# EAGLE design 8channelsULN2803 (EAGLE 5.11)
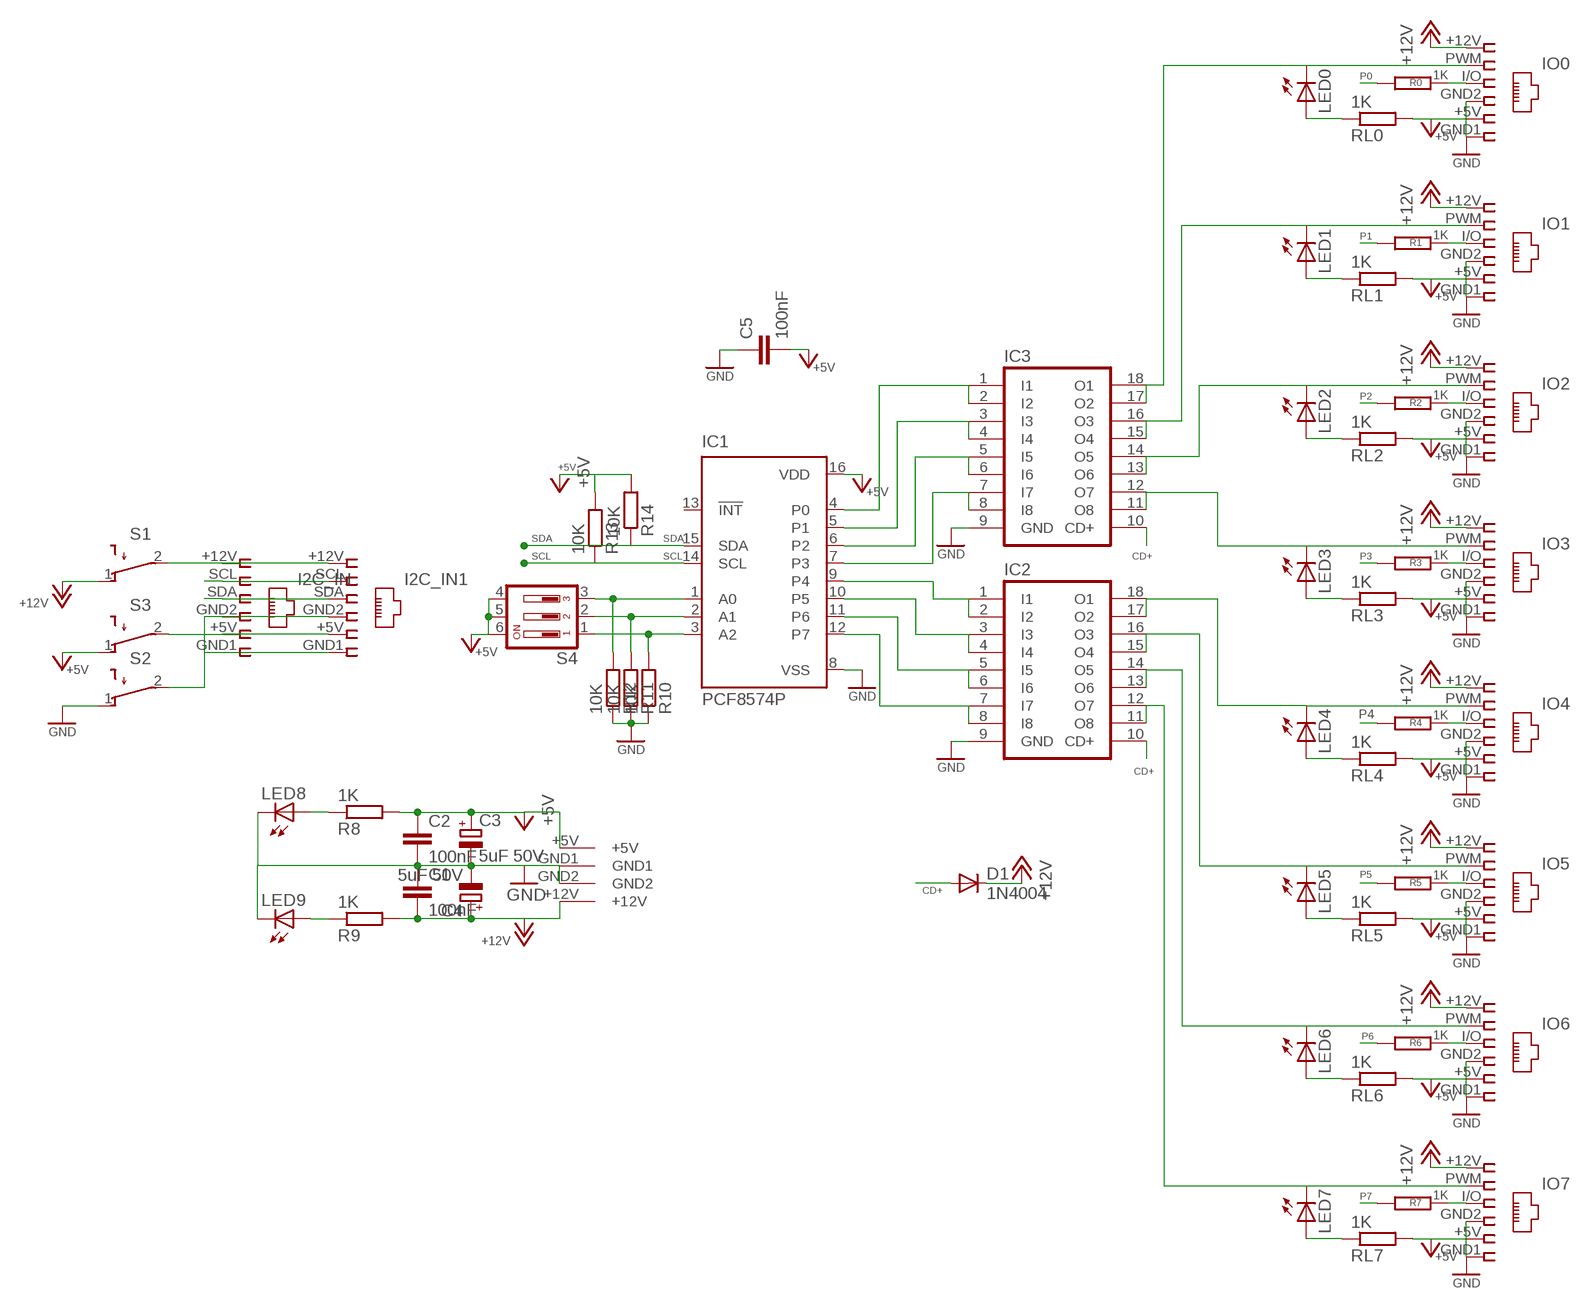
[diagram p0: schematic, sheet 1]

## Parts
C1  100nF  C-EUC1206  [C1206]
C2  100nF  C-EUC1206  [C1206]
C3  5uF 50V  CPOL-EUE3.5-8  [E3,5-8]
C4  5uF 50V  CPOL-EUE3.5-8  [E3,5-8]
C5  100nF  C-EUC1206  [C1206]
D1  1N4004  [DO41-10]
I2C_IN  I2C 1  RJ12STRAIGHT-I2C  [RJ12-STRAIGHT-I2C]
I2C_IN1  I2C 2  RJ12STRAIGHT-I2C  [RJ12-STRAIGHT-I2C]
IC1  PCF8574P  [DIL16]
IC2  ULN2803A  [DIL18]
IC3  ULN2803A  [DIL18]
IO0  IO0  RJ12STRAIGHT  [RJ12-STRAIGHT]
IO1  IO1  RJ12STRAIGHT  [RJ12-STRAIGHT]
IO2  IO2  RJ12STRAIGHT  [RJ12-STRAIGHT]
IO3  IO3  RJ12STRAIGHT  [RJ12-STRAIGHT]
IO4  IO4  RJ12STRAIGHT  [RJ12-STRAIGHT]
IO5  IO5  RJ12STRAIGHT  [RJ12-STRAIGHT]
IO6  IO6  RJ12STRAIGHT  [RJ12-STRAIGHT]
IO7  IO7  RJ12STRAIGHT  [RJ12-STRAIGHT]
LED0  LED3MM  [LED3MM]
LED1  LED3MM  [LED3MM]
LED2  LED3MM  [LED3MM]
LED3  LED3MM  [LED3MM]
LED4  LED3MM  [LED3MM]
LED5  LED3MM  [LED3MM]
LED6  LED3MM  [LED3MM]
LED7  LED3MM  [LED3MM]
LED8  LED3MM  [LED3MM]
LED9  LED3MM  [LED3MM]
R0  1K  R-EU_M1206  [M1206]
R1  1K  R-EU_M1206  [M1206]
R2  1K  R-EU_M1206  [M1206]
R3  1K  R-EU_M1206  [M1206]
R4  1K  R-EU_M1206  [M1206]
R5  1K  R-EU_M1206  [M1206]
R6  1K  R-EU_M1206  [M1206]
R7  1K  R-EU_M1206  [M1206]
R8  1K  R-EU_M1206  [M1206]
R9  1K  R-EU_M1206  [M1206]
R10  10K  R-EU_M1206  [M1206]
R11  10K  R-EU_M1206  [M1206]
R12  10K  R-EU_M1206  [M1206]
R13  10K  R-EU_M1206  [M1206]
R14  10K  R-EU_M1206  [M1206]
RL0  1K  R-EU_M1206  [M1206]
RL1  1K  R-EU_M1206  [M1206]
RL2  1K  R-EU_M1206  [M1206]
RL3  1K  R-EU_M1206  [M1206]
RL4  1K  R-EU_M1206  [M1206]
RL5  1K  R-EU_M1206  [M1206]
RL6  1K  R-EU_M1206  [M1206]
RL7  1K  R-EU_M1206  [M1206]
S1  SWITCHSWITCH  [SWITCH2]
S2  SWITCHPAD  [PADS2]
S3  SWITCHSWITCH  [SWITCH2]
S4  DIP03YL  [DIP03YL]
U$2  KPJX-4S-S  [KPJX-4S-S]

## Nets
+5V [highpower]: C2.1 C3.+ C5.2 IC1.16(VDD) IO0.+5V IO1.+5V IO2.+5V IO3.+5V IO4.+5V IO5.+5V IO6.+5V IO7.+5V R8.2 R13.2 R14.2 RL0.2 RL1.2 RL2.2 RL3.2 RL4.2 RL5.2 RL6.2 RL7.2 S3.1(O) S4.4 S4.5 S4.6 U$2.+5V
+12V [highpower]: C1.2 C4.+ D1.C IO0.+12V IO1.+12V IO2.+12V IO3.+12V IO4.+12V IO5.+12V IO6.+12V IO7.+12V R9.2 S1.1(O) U$2.+12V
CD+: D1.A IC2.10(CD+) IC3.10(CD+)
D2B: IO4.I/O R4.1
D2B1: IO5.I/O R5.1
D2B2: IO6.I/O R6.1
D2B3: IO7.I/O R7.1
D2B4: IO0.I/O R0.1
D2B5: IO1.I/O R1.1
D2B6: IO2.I/O R2.1
D2B7: IO3.I/O R3.1
GND [highpower]: C1.1 C2.2 C3.- C4.- C5.1 IC1.8(VSS) IC2.9(GND) IC3.9(GND) IO0.GND1 IO0.GND2 IO1.GND1 IO1.GND2 IO2.GND1 IO2.GND2 IO3.GND1 IO3.GND2 IO4.GND1 IO4.GND2 IO5.GND1 IO5.GND2 IO6.GND1 IO6.GND2 IO7.GND1 IO7.GND2 LED8.K(C) LED9.K(C) R10.1 R11.1 R12.1 S2.1(O) U$2.GND1 U$2.GND2
N$1 [power]: IC3.15(O4) IC3.16(O3) IO1.PWM LED1.K(C)
N$2: LED0.A RL0.1
N$3 [power]: IC3.17(O2) IC3.18(O1) IO0.PWM LED0.K(C)
N$4: LED1.A RL1.1
N$5 [highpower]: I2C_IN1.+12V I2C_IN.+12V S1.2(P)
N$6 [power]: IC2.13(O6) IC2.14(O5) IO6.PWM LED6.K(C)
N$7 [highpower]: I2C_IN1.+5V I2C_IN.+5V S3.2(P)
N$8 [power]: IC2.17(O2) IC2.18(O1) IO4.PWM LED4.K(C)
N$9 [power]: IC3.11(O8) IC3.12(O7) IO3.PWM LED3.K(C)
N$10 [highpower]: I2C_IN1.GND1 I2C_IN1.GND2 I2C_IN.GND1 I2C_IN.GND2 S2.2(P)
N$12: LED5.A RL5.1
N$13: LED9.A R9.1
N$15: LED4.A RL4.1
N$16: IC1.1(A0) R12.2 S4.3
N$17: IC1.2(A1) R11.2 S4.2
N$18: IC1.3(A2) R10.2 S4.1
N$21: LED6.A RL6.1
N$23: LED8.A R8.1
N$28: LED7.A RL7.1
N$38: LED2.A RL2.1
N$40 [power]: IC3.13(O6) IC3.14(O5) IO2.PWM LED2.K(C)
N$41: LED3.A RL3.1
N$42 [power]: IC2.15(O4) IC2.16(O3) IO5.PWM LED5.K(C)
N$44 [power]: IC2.11(O8) IC2.12(O7) IO7.PWM LED7.K(C)
P0: IC1.4(P0) IC3.1(I1) IC3.2(I2) R0.2
P1: IC1.5(P1) IC3.3(I3) IC3.4(I4) R1.2
P2: IC1.6(P2) IC3.5(I5) IC3.6(I6) R2.2
P3: IC1.7(P3) IC3.7(I7) IC3.8(I8) R3.2
P4: IC1.9(P4) IC2.1(I1) IC2.2(I2) R4.2
P5: IC1.10(P5) IC2.3(I3) IC2.4(I4) R5.2
P6: IC1.11(P6) IC2.5(I5) IC2.6(I6) R6.2
P7: IC1.12(P7) IC2.7(I7) IC2.8(I8) R7.2
SCL: I2C_IN1.SCL I2C_IN.SCL IC1.14(SCL) R13.1
SDA: I2C_IN1.SDA I2C_IN.SDA IC1.15(SDA) R14.1
Unconnected: IC1.13(!INT)

## Library data of the parts
C1 C2 C5 = rcl:C-EU: CAPACITOR, European symbol
C3 C4 = rcl:CPOL-EU: POLARIZED CAPACITOR, European symbol
D1 = diode:1N4004: DIODE general purpose rectifier, 1 A
I2C_IN I2C_IN1 IO0 IO1-IO7 = lpatiny:RJ12: CORCOM Modular RJ Jacks No Shield Source: www.tycoelectronics.com .. ENG_DS_1654001_1099_RJ_L_0507.pdf
IC1 = micro-philips:PCF8574: I2C-Bus Remote 8-bit I/O expander http://www.semiconductors.philips.com/acrobat_download/datasheets/PCF8574_4.pdf; MPN: PCF8574PN; OC_FARNELL: 204020; OC_NEWARK: 11N8515
IC2 IC3 = uln-udn:ULN2803A: DRIVER ARRAY
LED0 LED1-LED9 = lpatiny:LED3MM
R0 R1-R14 RL0 RL1-RL7 = resistor:R-EU_: RESISTOR, European symbol
S1-S3 = lpatiny:SWITCH: TOGGLE SWITCH
S4 = switch-dil:DIP03YL: DIL/CODE SWITCH; OC_FARNELL: unknown; OC_NEWARK: unknown
U$2 = lpatiny:KPJX-4S-S

## Net classes
0 default: width 0.457 mm
1 power: width 0.914 mm
2 highpower: width 1.372 mm

## Board
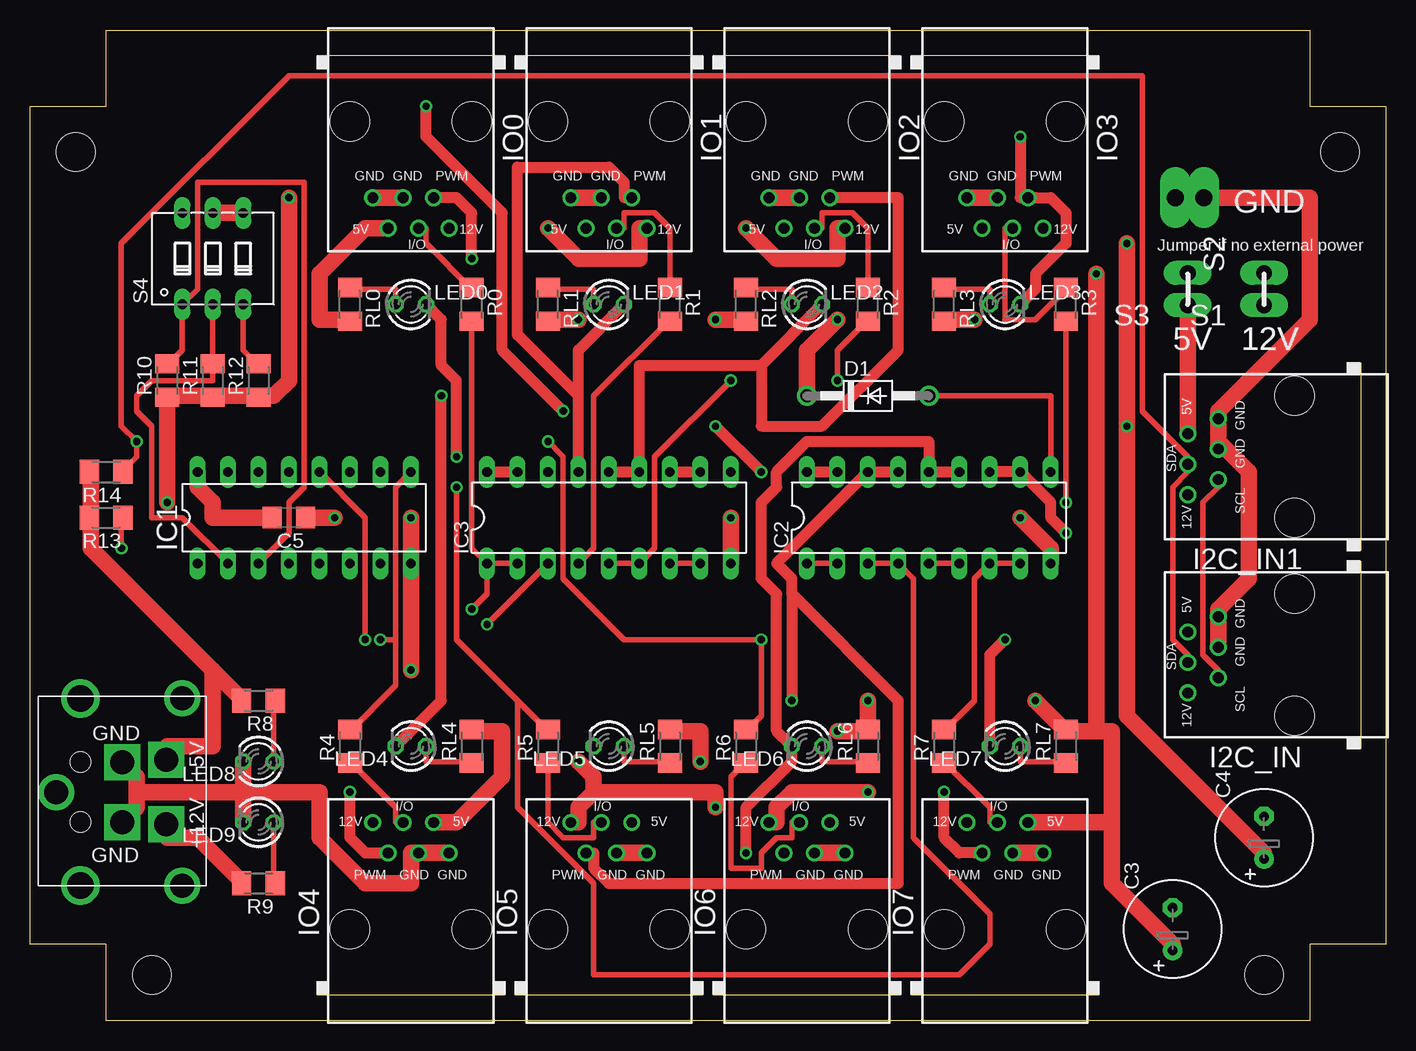
[diagram p1: board, top side]
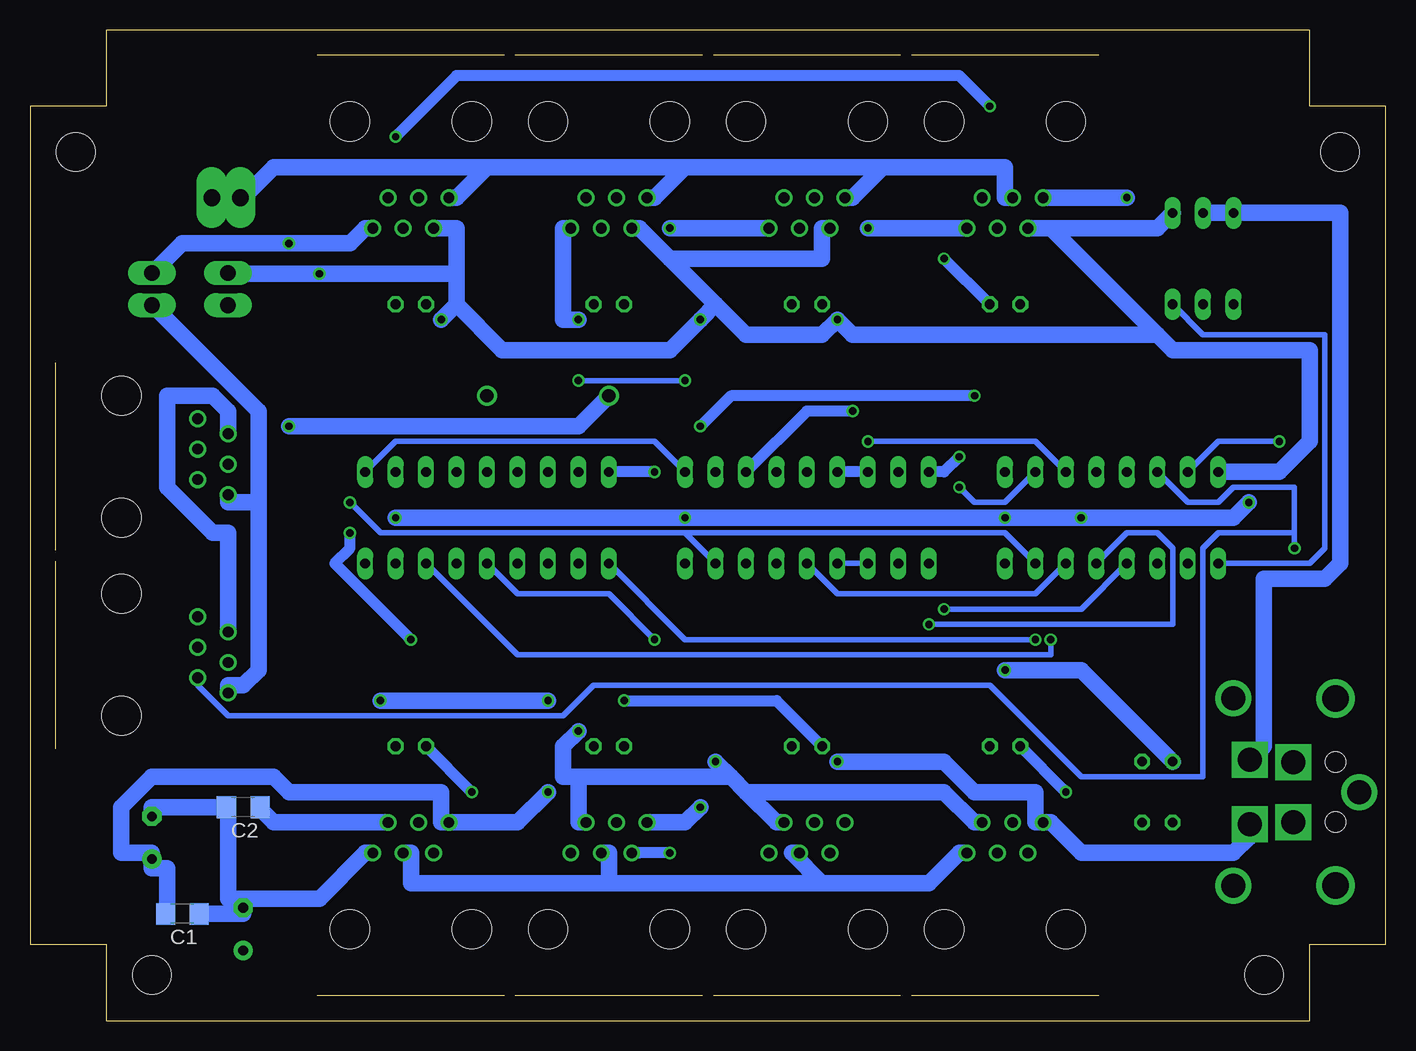
[diagram p2: board, bottom side, seen from below]

Size 113.03 x 82.55 mm. Coordinates in mm from the lower left corner, seen from the top.
Outline: 0,76.2 6.35,76.2 6.35,82.55 106.68,82.55 106.68,76.2 113.03,76.2 113.03,6.35 106.68,6.35 106.68,0 6.35,0 6.35,6.35 0,6.35 0,76.2
Copper layers (1*16): Top 0.035mm / dielectric 1.5mm / Bottom 0.035mm
Design rules "default": minimum track width 10mil, minimum drill 24mil, track to track 8mil, track to pad 8mil, pad to pad 8mil, via to via 8mil, smd to smd 8mil, copper to edge 40mil, drill to drill 8mil, minimum pad ring 10mil, minimum via ring 8mil, stop-mask expansion 4mil, vias tented up to drill 0mil, thermal gap 10mil
Holes 3.2 mm at 3.81,72.39 10.16,3.81 102.87,3.81 109.22,72.39
Milling: 13 lines

### Footprints (pad centres in the part's own frame; a part is rotated, then mirrored left to right if it is on the bottom)
C1206 = smd 1.6 x 1.8: 1 -1.4,0; 2 1.4,0
E3,5-8 = drill 0.813 pad 1.6 round: + -1.778,0 | drill 0.813 pad 1.6 octagon: - 1.778,0
DO41-10 = drill 1.118 round: A 5.08,0; C -5.08,0
RJ12-STRAIGHT-I2C = drill 0.9 pad 1.4 round: +5V 1.905,8.89; +12V -3.175,8.89; GND1 3.175,6.35; GND2 0.635,6.35; SCL -1.905,6.35; SDA -0.635,8.89 | hole 3.251: -5.08,0; 5.08,0
DIL16 = drill 0.813 long: 1 -8.89,-3.81; 2 -6.35,-3.81; 3 -3.81,-3.81; 4 -1.27,-3.81; 5 1.27,-3.81; 6 3.81,-3.81; 7 6.35,-3.81; 8 8.89,-3.81; 9 8.89,3.81; 10 6.35,3.81; 11 3.81,3.81; 12 1.27,3.81; 13 -1.27,3.81; 14 -3.81,3.81; 15 -6.35,3.81; 16 -8.89,3.81
DIL18 = drill 0.813 long: 1 -10.16,-3.81; 2 -7.62,-3.81; 3 -5.08,-3.81; 4 -2.54,-3.81; 5 0,-3.81; 6 2.54,-3.81; 7 5.08,-3.81; 8 7.62,-3.81; 9 10.16,-3.81; 10 10.16,3.81; 11 7.62,3.81; 12 5.08,3.81; 13 2.54,3.81; 14 0,3.81; 15 -2.54,3.81; 16 -5.08,3.81; 17 -7.62,3.81; 18 -10.16,3.81
RJ12-STRAIGHT = drill 0.9 pad 1.4 round: +5V 1.905,8.89; +12V -3.175,8.89; GND1 3.175,6.35; GND2 0.635,6.35; I/O -0.635,8.89; PWM -1.905,6.35 | hole 3.251: -5.08,0; 5.08,0
LED3MM = drill 0.813 octagon: A -1.27,0; K 1.27,0
M1206 = smd 1.6 x 2: 1 -1.4,0; 2 1.4,0
SWITCH2 = drill 1.3 pad 2 long: 1 0,-1.346; 2 0,1.346
PADS2 = drill 1.4 pad 2.54 long: 1 0,-1.029; 2 0,1.346
DIP03YL = drill 0.813 long: 1 -2.54,-3.81; 2 0,-3.81; 3 2.54,-3.81; 4 2.54,3.81; 5 0,3.81; 6 -2.54,3.81
KPJX-4S-S = drill 2 square: +5V 2.7,1.35; +12V -2.7,1.35; GND1 -2.5,5; GND2 2.5,5 | drill 2 round: P$1 -7.8,0; P$2 7.8,0; P$11 0,10.5 | drill 2.2 round: P$3 -7.8,8.5; P$4 7.8,8.5 | hole 1.7: -2.5,8.5; 2.5,8.5

### Placement (x,y rotation side)
C1  100.33,8.89 180 bottom
C2  95.25,17.78 180 bottom
C3  95.25,7.62 90 top
C4  102.87,15.24 90 top
C5  21.59,41.91 180 top
D1  69.85,52.07 0 top
I2C_IN  105.41,30.48 90 top
I2C_IN1  105.41,46.99 90 top
IC1  22.86,41.91 0 top
IC2  74.93,41.91 0 top
IC3  48.26,41.91 0 top
IO0  31.75,74.93 180 top
IO1  48.26,74.93 180 top
IO2  64.77,74.93 180 top
IO3  81.28,74.93 180 top
IO4  31.75,7.62 0 top
IO5  48.26,7.62 0 top
IO6  64.77,7.62 0 top
IO7  81.28,7.62 0 top
LED0  31.75,59.69 0 top
LED1  48.26,59.69 0 top
LED2  64.77,59.69 0 top
LED3  81.28,59.69 0 top
LED4  31.75,22.86 180 top
LED5  48.26,22.86 180 top
LED6  64.77,22.86 180 top
LED7  81.28,22.86 180 top
LED8  19.05,21.59 180 top
LED9  19.05,16.51 180 top
R0  36.83,59.69 270 top
R1  53.34,59.69 270 top
R2  69.85,59.69 270 top
R3  86.36,59.69 270 top
R4  26.67,22.86 90 top
R5  43.18,22.86 90 top
R6  59.69,22.86 90 top
R7  76.2,22.86 90 top
R8  19.05,26.67 180 top
R9  19.05,11.43 180 top
R10  11.43,53.34 90 top
R11  15.24,53.34 90 top
R12  19.05,53.34 90 top
R13  6.35,41.91 180 top
R14  6.35,45.72 180 top
RL0  26.67,59.69 270 top
RL1  43.18,59.69 270 top
RL2  59.69,59.69 270 top
RL3  76.2,59.69 270 top
RL4  36.83,22.86 90 top
RL5  53.34,22.86 90 top
RL6  69.85,22.86 90 top
RL7  86.36,22.86 90 top
S1  102.87,60.96 180 top
S2  96.52,68.58 270 top
S3  96.52,60.96 180 top
S4  15.24,63.5 0 top
U$2  12.7,19.05 90 top

### Tracks (layer width: path | path; a pad name or v marks a point on that pad's centre or on a via)
+5V  (via drill 0.61)
  Top 1.372: RL4.2 36.83,24.13 39.37,24.13 39.37,20.32 35.56,16.51 34.29,16.51 IO4.+5V | v55.88,21.59 55.88,24.13 53.34,24.13 RL5.2 | 69.85,24.13 v67.31,24.13 | RL6.2 69.85,24.13 | 15.24,29.21 5.08,39.37 5.08,41.91 | 15.24,29.21 17.78,26.67 R8.2 | 5.08,41.91 R13.2 5.08,41.91 | 5.08,41.91 5.08,45.72 R14.2 | 15.24,29.21 15.24,22.86 11.43,22.86 U$2.+5V | 88.9,24.13 90.17,24.13 90.17,16.51 | 88.9,24.13 86.36,24.13 | 90.17,16.51 90.17,11.43 95.25,6.35 C3.+ | 86.36,24.13 RL7.2 86.36,24.13 | 90.17,16.51 83.82,16.51 IO7.+5V | v78.74,58.42 76.2,58.42 RL3.2 | v45.72,58.42 43.18,58.42 RL1.2 | v57.15,58.42 59.69,58.42 RL2.2 | C5.2 15.24,41.91 15.24,43.18 13.97,44.45 IC1.16 | C5.2 20.32,41.91 C5.2 | S4.5 S4.4 | RL0.2 26.67,58.42 24.13,58.42 24.13,62.23 27.94,66.04 29.21,66.04 IO0.+5V | v88.9,62.23 88.9,24.13 | v69.85,26.67 RL6.2 | RL6.2 69.85,24.13 | 86.36,24.13 v83.82,26.67 | RL6.2 69.85,24.13
  Bottom 1.372: 53.34,19.05 50.8,16.51 IO5.+5V | 54.61,20.32 53.34,19.05 | 54.61,20.32 v55.88,21.59 | v67.31,24.13 68.58,22.86 68.58,20.32 67.31,20.32 | 67.31,20.32 54.61,20.32 | 67.31,20.32 67.31,16.51 IO6.+5V | 53.34,19.05 36.83,19.05 34.29,16.51 IO4.+5V | C2.1 93.98,17.78 92.71,16.51 83.82,16.51 IO7.+5V | 77.47,59.69 v78.74,58.42 | 77.47,62.23 77.47,66.04 78.74,66.04 IO3.+5V | 77.47,59.69 77.47,62.23 | 77.47,62.23 v88.9,62.23 96.52,62.23 S3.1 | 59.69,63.5 62.23,66.04 IO2.+5V | 55.88,59.69 59.69,63.5 | 55.88,59.69 53.34,57.15 46.99,57.15 v45.72,58.42 44.45,57.15 19.05,57.15 | 55.88,59.69 v57.15,58.42 59.69,55.88 73.66,55.88 77.47,59.69 | 59.69,63.5 46.99,63.5 46.99,66.04 IO1.+5V | S4.5 S4.6 3.81,67.31 3.81,38.1 5.08,36.83 10.16,36.83 10.16,22.86 U$2.+5V | S4.4 19.05,66.04 27.94,66.04 | 27.94,66.04 29.21,66.04 IO0.+5V | IC1.16 8.89,45.72 6.35,48.26 6.35,55.88 17.78,55.88 19.05,57.15 | 27.94,66.04 19.05,57.15 | v83.82,26.67 v69.85,26.67
+12V  (via drill 0.61)
  Top 1.372: v43.18,66.04 45.72,63.5 50.8,63.5 50.8,66.04 IO1.+12V | v67.31,58.42 64.77,55.88 D1.C | v59.69,66.04 62.23,63.5 67.31,63.5 67.31,66.04 IO2.+12V | R9.2 17.78,11.43 13.97,15.24 11.43,15.24 U$2.+12V | 46.99,19.05 45.72,17.78 45.72,16.51 IO5.+12V | 46.99,19.05 57.15,19.05 v57.15,17.78 | v69.85,19.05 63.5,19.05 62.23,17.78 62.23,16.51 IO6.+12V | v91.44,64.77 v91.44,49.53 91.44,25.4 102.87,13.97 C4.+ | v45.72,21.59 46.99,20.32 46.99,19.05
  Bottom 1.372: v43.18,66.04 35.56,66.04 IO0.+12V | v67.31,58.42 68.58,58.42 68.58,66.04 IO2.+12V | v59.69,66.04 52.07,66.04 IO1.+12V | U$2.+12V 11.43,15.24 12.7,13.97 25.4,13.97 27.94,16.51 IO4.+12V 29.21,16.51 29.21,19.05 34.29,19.05 36.83,21.59 v45.72,21.59 | IO3.+12V 85.09,66.04 86.36,64.77 v91.44,64.77 100.33,64.77 102.87,62.23 S1.1 | v57.15,17.78 58.42,16.51 60.96,16.51 IO6.+12V | C1.2 101.6,8.89 101.6,12.7 102.87,12.7 C4.+ 102.87,13.97 105.41,13.97 105.41,17.78 102.87,20.32 92.71,20.32 91.44,19.05 78.74,19.05 78.74,16.51 IO7.+12V 77.47,16.51 72.39,16.51 v69.85,19.05 | D1.C 67.31,49.53 v91.44,49.53
CD+
  Top 0.457: D1.A 85.09,52.07 IC2.10
  Bottom 0.457: IC3.10 60.96,48.26 82.55,48.26 IC2.10
D2B
  Top 0.457: R4.1 26.67,21.59 30.48,17.78 30.48,16.51 IO4.I/O
D2B1
  Top 0.457: R5.1 43.18,16.51 44.45,15.24 46.99,15.24 46.99,16.51 IO5.I/O | R5.1 43.18,21.59 R5.1
D2B2
  Top 0.457: R6.1 59.69,21.59 58.42,20.32 58.42,12.7 60.96,12.7 60.96,13.97 62.23,15.24 63.5,15.24 63.5,16.51 IO6.I/O
D2B3
  Top 0.457: R7.1 76.2,21.59 80.01,17.78 80.01,16.51 IO7.I/O
D2B4
  Top 0.457: R0.1 36.83,60.96 33.02,64.77 33.02,66.04 IO0.I/O
D2B5
  Top 0.457: R1.1 53.34,66.04 52.07,67.31 49.53,67.31 49.53,66.04 IO1.I/O | R1.1 53.34,60.96 R1.1
D2B6
  Top 0.457: R2.1 69.85,66.04 68.58,67.31 66.04,67.31 66.04,66.04 IO2.I/O | R2.1 69.85,60.96 R2.1
D2B7
  Top 0.457: R3.1 86.36,60.96 83.82,58.42 81.28,58.42 81.28,66.04 IO3.I/O
GND  (via drill 0.61)
  Top 1.372: IO7.GND2 82.55,13.97 83.82,13.97 IO7.GND1 | 17.78,19.05 LED8.K | 17.78,19.05 LED9.K | 8.89,19.05 17.78,19.05 | 8.89,19.05 8.89,20.32 U$2.GND2 | 8.89,19.05 8.89,17.78 U$2.GND1 | IO6.GND2 66.04,13.97 67.31,13.97 IO6.GND1 | IO4.GND1 34.29,13.97 33.02,13.97 IO4.GND2 31.75,13.97 31.75,11.43 27.94,11.43 24.13,15.24 24.13,19.05 17.78,19.05 | IO5.GND2 49.53,13.97 50.8,13.97 IO5.GND1 | IO3.GND1 78.74,68.58 80.01,68.58 IO3.GND2 | IO2.GND1 62.23,68.58 63.5,68.58 IO2.GND2 | IO0.GND1 29.21,68.58 30.48,68.58 IO0.GND2 | IO1.GND1 45.72,68.58 46.99,68.58 IO1.GND2 | 11.43,52.07 15.24,52.07 | R10.1 11.43,52.07 | 15.24,52.07 R11.1 15.24,52.07 | 15.24,52.07 19.05,52.07 | 19.05,52.07 R12.1 19.05,52.07 | v25.4,41.91 C5.1 | C5.1 22.86,41.91 C5.1 | v31.75,41.91 IC1.8 v31.75,29.21 | v58.42,41.91 IC3.9 | IC2.9 85.09,39.37 v82.55,41.91 | v11.43,43.18 R10.1 | R10.1 11.43,52.07 | R10.1 11.43,52.07 | v21.59,68.58 21.59,53.34 20.32,52.07 19.05,52.07
  Bottom 1.372: C2.2 102.87,17.78 C4.- | 96.52,17.78 C2.2 | 96.52,17.78 C2.2 | C1.1 95.25,8.89 C3.- | C1.1 99.06,8.89 C1.1 | 95.25,10.16 88.9,10.16 85.09,13.97 IO7.GND1 | 95.25,10.16 C3.- | 96.52,17.78 96.52,10.16 95.25,10.16 | 96.52,17.78 C2.2 | 95.25,10.16 C3.- | 46.99,11.43 38.1,11.43 35.56,13.97 IO4.GND1 | 46.99,11.43 49.53,13.97 IO5.GND2 | 64.77,11.43 64.77,13.97 IO6.GND2 | 46.99,11.43 64.77,11.43 | 64.77,11.43 81.28,11.43 81.28,13.97 IO7.GND2 | 41.91,71.12 31.75,71.12 31.75,68.58 IO0.GND2 | 41.91,71.12 44.45,68.58 IO1.GND1 | 58.42,71.12 60.96,68.58 IO2.GND1 | 41.91,71.12 58.42,71.12 | 74.93,71.12 77.47,68.58 IO3.GND1 | 58.42,71.12 74.93,71.12 | 74.93,71.12 92.71,71.12 95.25,68.58 S2.1 | v82.55,41.91 v58.42,41.91 v31.75,41.91 v25.4,41.91 12.7,41.91 v11.43,43.18 | v21.59,68.58 27.94,68.58 IO0.GND1 | LED8.K 25.4,29.21 v31.75,29.21
N$1
  Top 0.914: LED1.K 45.72,55.88 45.72,52.07 | IC3.15 45.72,52.07 | 45.72,52.07 40.64,57.15 40.64,71.12 48.26,71.12 49.53,69.85 49.53,68.58 IO1.PWM
  Bottom 0.914: IC3.16 IC3.15
N$2
  Top 0.457: LED0.A 30.48,60.96 26.67,60.96 RL0.1
N$3  (via drill 0.61)
  Top 0.914: IC3.18 IC3.17 | LED0.K 34.29,58.42 34.29,54.61 35.56,53.34 v35.56,46.99 | v36.83,63.5 36.83,67.31 35.56,68.58 34.29,68.58 IO0.PWM
  Bottom 0.914: v35.56,46.99 36.83,45.72 IC3.18 | LED0.K v36.83,63.5
N$4
  Top 0.457: LED1.A 46.99,60.96 43.18,60.96 RL1.1
N$5
  Bottom 1.372: 93.98,43.18 93.98,29.21 95.25,27.94 96.52,27.94 I2C_IN.+12V | 93.98,43.18 96.52,43.18 I2C_IN1.+12V | 93.98,43.18 93.98,50.8 102.87,59.69 S1.2
N$6  (via drill 0.61)
  Top 0.914: IC2.13 IC2.14 74.93,48.26 64.77,48.26 62.23,45.72 62.23,44.45 60.96,43.18 60.96,36.83 62.23,35.56 62.23,24.13 LED6.K 63.5,21.59 59.69,17.78 v59.69,13.97
  Bottom 0.914: v59.69,13.97 62.23,13.97 IO6.PWM
N$7
  Top 1.372: S3.2 96.52,49.53 I2C_IN1.+5V | S3.2 96.52,59.69 S3.2
  Bottom 1.372: I2C_IN.+5V 96.52,33.02 96.52,40.64 97.79,40.64 101.6,44.45 101.6,52.07 97.79,52.07 96.52,50.8 96.52,49.53 I2C_IN1.+5V
N$8  (via drill 0.61)
  Top 0.914: IC2.18 IC2.17 | v26.67,19.05 26.67,15.24 27.94,13.97 29.21,13.97 IO4.PWM | v57.15,49.53 v60.96,45.72 | v34.29,52.07 34.29,26.67 LED4.K
  Bottom 0.914: v26.67,19.05 LED4.K | v60.96,45.72 IC2.18 | v57.15,49.53 54.61,52.07 v34.29,52.07
N$9  (via drill 0.61)
  Top 0.914: IC3.12 IC3.11 | LED3.K 83.82,60.96 83.82,62.23 86.36,64.77 86.36,67.31 85.09,68.58 83.82,68.58 IO3.PWM 82.55,68.58 v82.55,73.66 | v44.45,50.8 39.37,55.88 39.37,67.31 33.02,73.66 v33.02,76.2
  Bottom 0.914: IC3.12 48.26,50.8 v44.45,50.8 | v33.02,76.2 35.56,78.74 77.47,78.74 v82.55,73.66
N$10
  Top 1.372: I2C_IN.GND2 99.06,31.75 99.06,33.02 I2C_IN.GND1 99.06,34.29 101.6,36.83 101.6,45.72 99.06,48.26 | 99.06,48.26 99.06,49.53 I2C_IN1.GND1 99.06,50.8 106.68,58.42 106.68,68.58 99.06,68.58 S2.2 | 99.06,48.26 I2C_IN1.GND2 99.06,48.26
N$12
  Top 0.457: LED5.A 49.53,21.59 53.34,21.59 RL5.1
N$13
  Top 0.457: LED9.A 20.32,11.43 R9.1
N$15
  Top 0.457: LED4.A 33.02,21.59 36.83,21.59 RL4.1
N$16
  Top 0.457: S4.3 17.78,55.88 19.05,54.61 R12.2
  Bottom 0.457: IC1.1 6.35,38.1 5.08,39.37 5.08,57.15 15.24,57.15 S4.3
N$17
  Top 0.457: R11.2 S4.2 | 15.24,54.61 R11.2 | 15.24,54.61 R11.2 | IC1.2 12.7,41.91 10.16,41.91 10.16,49.53 8.89,50.8 8.89,52.07 10.16,53.34 15.24,53.34 15.24,54.61 | 15.24,54.61 R11.2
N$18
  Top 0.457: R10.2 11.43,54.61 12.7,55.88 S4.1 13.97,60.96 13.97,69.85 22.86,69.85 22.86,44.45 21.59,43.18 21.59,40.64 IC1.3
N$21
  Top 0.457: LED6.A 66.04,21.59 69.85,21.59 RL6.1
N$23
  Top 0.457: LED8.A 20.32,26.67 R8.1
N$28
  Top 0.457: LED7.A 82.55,21.59 86.36,21.59 RL7.1
N$38
  Top 0.457: LED2.A 63.5,60.96 59.69,60.96 RL2.1
N$40
  Top 0.914: IC3.14 IC3.13 50.8,54.61 60.96,54.61 | 60.96,54.61 LED2.K | 60.96,54.61 60.96,49.53 66.04,49.53 72.39,55.88 72.39,68.58 67.31,68.58 IO2.PWM
N$41
  Top 0.457: LED3.A 80.01,60.96 76.2,60.96 RL3.1
N$42  (via drill 0.61)
  Top 0.914: 63.5,35.56 63.5,36.83 62.23,38.1 IC2.16 IC2.15 | 63.5,35.56 v63.5,26.67 | 63.5,35.56 72.39,26.67 72.39,11.43 48.26,11.43 46.99,12.7 46.99,13.97 IO5.PWM
  Bottom 0.914: LED5.K 50.8,26.67 v63.5,26.67
N$44  (via drill 0.61)
  Top 0.914: IC2.12 IC2.11 85.09,43.18 85.09,41.91 v86.36,40.64 | v76.2,19.05 76.2,15.24 77.47,13.97 78.74,13.97 IO7.PWM | v81.28,31.75 80.01,30.48 LED7.K
  Bottom 0.914: v76.2,19.05 LED7.K | v86.36,40.64 86.36,39.37 87.63,38.1 v81.28,31.75
P0  (via drill 0.61)
  Top 0.457: R0.2 36.83,39.37 IC3.1 | R0.2 36.83,58.42 R0.2 | v36.83,34.29 38.1,35.56 IC3.1 | IC3.1 IC3.2
  Bottom 0.457: IC1.4 25.4,34.29 v36.83,34.29
P1  (via drill 0.61)
  Top 0.457: IC3.4 46.99,39.37 46.99,52.07 53.34,58.42 R1.2 | v38.1,33.02 IC3.3
  Bottom 0.457: IC1.5 21.59,40.64 19.05,40.64 17.78,39.37 17.78,33.02 v38.1,33.02 | IC3.3 IC3.4
P2  (via drill 0.61)
  Top 0.457: v67.31,53.34 67.31,55.88 69.85,58.42 R2.2 | v58.42,53.34 52.07,46.99 52.07,39.37 IC3.6 IC3.5
  Bottom 0.457: IC1.6 29.21,35.56 45.72,35.56 IC3.5 | v58.42,53.34 v67.31,53.34
P3  (via drill 0.61)
  Top 0.457: v86.36,43.18 R3.2 | R3.2 86.36,58.42 R3.2 | IC3.8 IC3.7
  Bottom 0.457: v86.36,43.18 83.82,40.64 58.42,40.64 | 58.42,40.64 IC3.8 | IC1.7 31.75,40.64 58.42,40.64
P4  (via drill 0.61)
  Top 0.457: IC2.1 IC2.2 | 30.48,31.75 30.48,44.45 IC1.9 | 30.48,31.75 30.48,27.94 26.67,24.13 R4.2 | 30.48,31.75 v29.21,31.75
  Bottom 0.457: IC2.1 58.42,31.75 v29.21,31.75
P5  (via drill 0.61)
  Top 0.457: IC2.3 IC2.4 73.66,36.83 73.66,15.24 80.01,8.89 80.01,6.35 77.47,3.81 46.99,3.81 46.99,11.43 40.64,17.78 40.64,26.67 | 40.64,26.67 35.56,31.75 v35.56,44.45 | 40.64,26.67 43.18,24.13 R5.2
  Bottom 0.457: v35.56,44.45 34.29,43.18 31.75,43.18 IC1.10
P6  (via drill 0.61)
  Top 0.457: R6.2 59.69,24.13 60.96,25.4 v60.96,31.75 49.53,31.75 44.45,36.83 44.45,46.99 v43.18,48.26 | IC2.5 IC2.6
  Bottom 0.457: v60.96,31.75 64.77,35.56 72.39,35.56 IC2.5 | IC1.11 29.21,48.26 v43.18,48.26
P7  (via drill 0.61)
  Top 0.457: R7.2 76.2,24.13 78.74,26.67 78.74,36.83 IC2.7 IC2.8 | IC1.12 27.94,41.91 v27.94,31.75
  Bottom 0.457: v27.94,31.75 27.94,30.48 72.39,30.48 IC2.7
SCL  (via drill 0.61)
  Top 0.457: v7.62,39.37 7.62,41.91 R13.1 | I2C_IN.SCL 99.06,29.21 97.79,30.48 97.79,43.18 99.06,44.45 I2C_IN1.SCL
  Bottom 0.457: 7.62,40.64 7.62,44.45 12.7,44.45 13.97,43.18 16.51,43.18 IC1.14 | 7.62,40.64 v7.62,39.37 | 7.62,40.64 13.97,40.64 15.24,39.37 15.24,20.32 25.4,20.32 33.02,27.94 66.04,27.94 68.58,25.4 96.52,25.4 99.06,27.94 I2C_IN.SCL
SDA  (via drill 0.61)
  Top 0.457: R14.1 7.62,45.72 8.89,46.99 v8.89,48.26 7.62,49.53 7.62,64.77 21.59,78.74 92.71,78.74 92.71,50.8 96.52,46.99 I2C_IN1.SDA 96.52,45.72 95.25,44.45 95.25,31.75 96.52,30.48 I2C_IN.SDA
  Bottom 0.457: v8.89,48.26 13.97,48.26 IC1.15

### Text on the board
tPlace: GND | Jumper if no external power | 5V | 12V | 12V